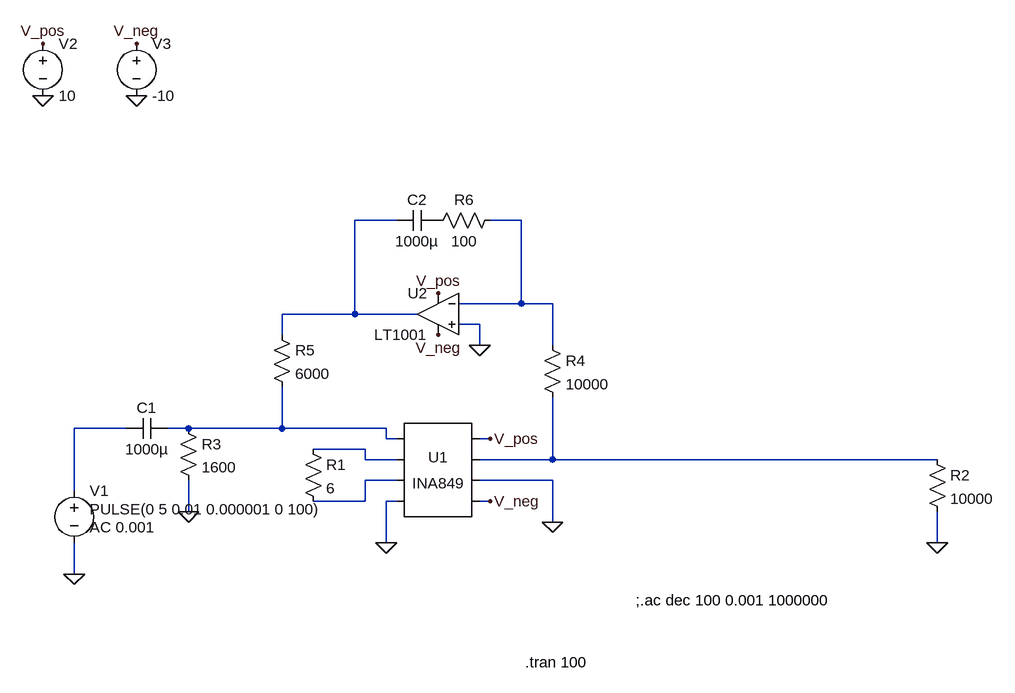
[diagram p0: schematic noiseamp_tests.asc]
noiseamp_tests.asc, the LTspice schematic file:
Version 4
SHEET 1 880 680
WIRE -272 -592 -336 -592
WIRE -80 -592 -128 -592
WIRE -80 -464 -80 -592
WIRE -80 -464 -176 -464
WIRE -32 -464 -80 -464
WIRE -336 -448 -336 -592
WIRE -336 -448 -448 -448
WIRE -240 -448 -336 -448
WIRE -144 -432 -176 -432
WIRE -448 -416 -448 -448
WIRE -144 -400 -144 -432
WIRE -32 -400 -32 -464
WIRE -688 -272 -768 -272
WIRE -592 -272 -624 -272
WIRE -448 -272 -448 -336
WIRE -448 -272 -592 -272
WIRE -288 -272 -448 -272
WIRE -288 -256 -288 -272
WIRE -272 -256 -288 -256
WIRE -128 -256 -144 -256
WIRE -320 -240 -400 -240
WIRE -320 -224 -320 -240
WIRE -272 -224 -320 -224
WIRE -32 -224 -32 -320
WIRE -32 -224 -144 -224
WIRE 560 -224 -32 -224
WIRE -272 -192 -320 -192
WIRE -32 -192 -144 -192
WIRE -768 -176 -768 -272
WIRE -320 -160 -320 -192
WIRE -320 -160 -400 -160
WIRE -272 -160 -288 -160
WIRE -128 -160 -144 -160
WIRE -592 -144 -592 -192
WIRE -32 -128 -32 -192
WIRE -288 -96 -288 -160
WIRE 560 -96 560 -144
WIRE -768 -48 -768 -96
FLAG -768 -48 0
FLAG 560 -96 0
FLAG -32 -128 0
FLAG -128 -256 V_pos
FLAG -128 -160 V_neg
FLAG -816 -784 0
FLAG -672 -784 0
FLAG -816 -864 V_pos
FLAG -672 -864 V_neg
FLAG -288 -96 0
FLAG -592 -144 0
FLAG -144 -400 0
FLAG -208 -480 V_pos
FLAG -208 -416 V_neg
SYMBOL AutoGenerated\\INA849 -208 -208 R0
SYMATTR InstName U1
SYMBOL res -416 -256 R0
SYMATTR InstName R1
SYMATTR Value 6
SYMBOL voltage -768 -192 R0
WINDOW 3 24 44 Left 2
WINDOW 123 24 72 Left 2
WINDOW 39 0 0 Left 0
SYMATTR InstName V1
SYMATTR Value PULSE(0 5 0.01 0.000001 0 100)
SYMATTR Value2 AC 0.001
SYMBOL res 544 -240 R0
SYMATTR InstName R2
SYMATTR Value 10000
SYMBOL voltage -816 -880 R0
WINDOW 123 0 0 Left 0
WINDOW 39 0 0 Left 0
SYMATTR InstName V2
SYMATTR Value 10
SYMBOL voltage -672 -880 R0
WINDOW 123 0 0 Left 0
WINDOW 39 0 0 Left 0
SYMATTR InstName V3
SYMATTR Value -10
SYMBOL cap -624 -288 R90
WINDOW 0 0 32 VBottom 2
WINDOW 3 32 32 VTop 2
SYMATTR InstName C1
SYMATTR Value 1000µ
SYMBOL res -608 -288 R0
SYMATTR InstName R3
SYMATTR Value 1600
SYMBOL res -48 -416 R0
SYMATTR InstName R4
SYMATTR Value 10000
SYMBOL res -464 -432 R0
SYMATTR InstName R5
SYMATTR Value 6000
SYMBOL OpAmps\\LT1001 -208 -512 M0
SYMATTR InstName U2
SYMBOL cap -208 -608 R90
WINDOW 0 0 32 VBottom 2
WINDOW 3 32 32 VTop 2
SYMATTR InstName C2
SYMATTR Value 1000µ
SYMBOL res -112 -608 R90
WINDOW 0 0 56 VBottom 2
WINDOW 3 32 56 VTop 2
SYMATTR InstName R6
SYMATTR Value 100
TEXT -74 88 Left 2 !.tran 100
TEXT 96 -8 Left 2 !;.ac dec 100 0.001 1000000

The netlist it stands for:
* noiseamp_tests.asc
* U1: INA849 (symbol AutoGenerated\INA849 not available, pins judged from their places): pin1=N004 pin2=N005 pin3=N007 pin4=0 pin5=V_pos pin6=N006 pin7=0 pin8=V_neg
R1 N005 N007 6
V1 N003 0 PULSE(0 5 0.01 0.000001 0 100) AC 0.001
R2 N006 0 10000
V2 V_pos 0 10
V3 V_neg 0 -10
C1 N004 N003 1000µ
R3 N004 0 1600
R4 N002 N006 10000
R5 N001 N004 6000
XU2 0 N002 V_pos V_neg N001 LT1001  ; pins In+ In- V+ V- OUT
C2 P001 N001 1000µ
R6 N002 P001 100
.tran 100
;.ac dec 100 0.001 1000000
.lib LTC.lib
.backanno
.end